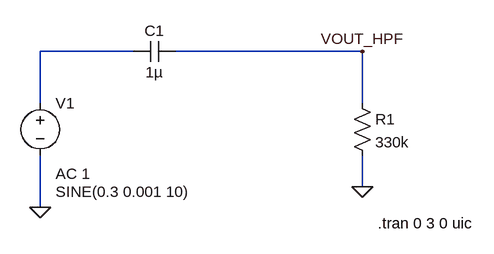
[diagram p0: schematic HPF_stage.asc]
HPF_stage.asc, the LTspice schematic file:
Version 4.1
SHEET 1 1336 680
WIRE 288 64 144 64
WIRE 640 64 352 64
WIRE 144 144 144 64
WIRE 640 144 640 64
WIRE 640 272 640 224
WIRE 144 304 144 224
FLAG 640 272 0
FLAG 144 304 0
FLAG 640 64 VOUT_HPF
SYMBOL voltage 144 128 R0
WINDOW 3 24 152 Left 2
WINDOW 123 24 124 Left 2
WINDOW 39 0 0 Left 0
SYMATTR InstName V1
SYMATTR Value SINE(0.3 0.001 10)
SYMATTR Value2 AC 1
SYMBOL res 624 128 R0
SYMATTR InstName R1
SYMATTR Value 330k
SYMBOL cap 352 48 R90
WINDOW 0 0 32 VBottom 2
WINDOW 3 32 32 VTop 2
SYMATTR InstName C1
SYMATTR Value 1µ
TEXT 664 328 Left 2 !.tran 0 3 0 uic

The netlist it stands for:
* HPF_stage.asc
V1 N001 0 SINE(0.3 0.001 10) AC 1
R1 VOUT_HPF 0 330k
C1 VOUT_HPF N001 1µ
.tran 0 3 0 uic
.backanno
.end